# Altium schematic sheet 3-core_board.SchDoc
size B
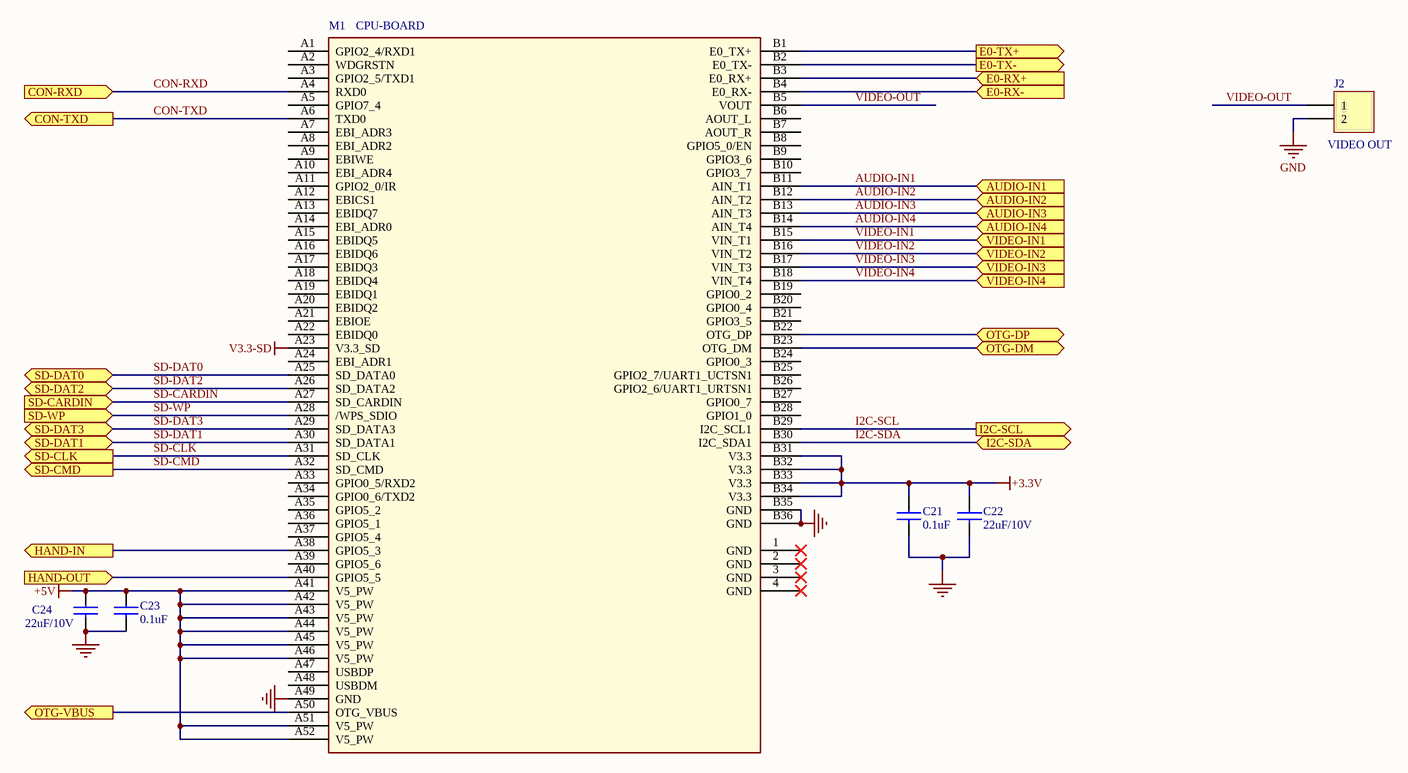
[diagram p0: 3-core_board.SchDoc]

## Parts
C21  0.1uF  [0603]
C22  22uF/10V  [1210]
C23  0.1uF  [0603]
C24  22uF/10V  [1210]
J2  VIDEO OUT  [CON-2PIN]
M1  CPU-BOARD  [cpu-board]

## Ports
AUDIO-IN1 (in), AUDIO-IN2 (in), AUDIO-IN3 (in), AUDIO-IN4 (in), CON-RXD (in), CON-TXD (out), E0-RX+ (in), E0-RX- (in), E0-TX+ (out), E0-TX- (out), HAND-IN (out), HAND-OUT (in), I2C-SCL (out), I2C-SDA (bidir), OTG-DM (bidir), OTG-DP (bidir), OTG-VBUS (out), SD-CARDIN (in), SD-CLK (out), SD-CMD (out), SD-DAT0 (bidir), SD-DAT1 (bidir), SD-DAT2 (bidir), SD-DAT3 (bidir), SD-WP (in), VIDEO-IN1 (in), VIDEO-IN2 (in), VIDEO-IN3 (in), VIDEO-IN4 (in)

## Nets
+3.3V: C21.1 C22.1 M1.B31(V3.3) M1.B32(V3.3) M1.B33(V3.3) M1.B34(V3.3)
+5V: C23.1 C24.1 M1.A41(V5_PW) M1.A42(V5_PW) M1.A43(V5_PW) M1.A44(V5_PW) M1.A45(V5_PW) M1.A46(V5_PW) M1.A51(V5_PW) M1.A52(V5_PW)
GND: C21.2 C22.2 C23.2 C24.2 J2.2 M1.A49(GND) M1.B35(GND) M1.B36(GND)
V3.3-SD: M1.A23(V3.3_SD)
AUDIO-IN1: M1.B11(AIN_T1) ; port AUDIO-IN1
AUDIO-IN2: M1.B12(AIN_T2) ; port AUDIO-IN2
AUDIO-IN3: M1.B13(AIN_T3) ; port AUDIO-IN3
AUDIO-IN4: M1.B14(AIN_T4) ; port AUDIO-IN4
CON-RXD: M1.A4(RXD0) ; port CON-RXD
CON-TXD: M1.A6(TXD0) ; port CON-TXD
E0-RX+: M1.B3(E0_RX+) ; port E0-RX+
E0-RX-: M1.B4(E0_RX-) ; port E0-RX-
E0-TX+: M1.B1(E0_TX+) ; port E0-TX+
E0-TX-: M1.B2(E0_TX-) ; port E0-TX-
HAND-IN: M1.A38(GPIO5_3) ; port HAND-IN
HAND-OUT: M1.A40(GPIO5_5) ; port HAND-OUT
I2C-SCL: M1.B29(I2C_SCL1) ; port I2C-SCL
I2C-SDA: M1.B30(I2C_SDA1) ; port I2C-SDA
OTG-DM: M1.B23(OTG_DM) ; port OTG-DM
OTG-DP: M1.B22(OTG_DP) ; port OTG-DP
OTG-VBUS: M1.A50(OTG_VBUS) ; port OTG-VBUS
SD-CARDIN: M1.A27(SD_CARDIN) ; port SD-CARDIN
SD-CLK: M1.A31(SD_CLK) ; port SD-CLK
SD-CMD: M1.A32(SD_CMD) ; port SD-CMD
SD-DAT0: M1.A25(SD_DATA0) ; port SD-DAT0
SD-DAT1: M1.A30(SD_DATA1) ; port SD-DAT1
SD-DAT2: M1.A26(SD_DATA2) ; port SD-DAT2
SD-DAT3: M1.A29(SD_DATA3) ; port SD-DAT3
SD-WP: M1.A28(/WPS_SDIO) ; port SD-WP
VIDEO-IN1: M1.B15(VIN_T1) ; port VIDEO-IN1
VIDEO-IN2: M1.B16(VIN_T2) ; port VIDEO-IN2
VIDEO-IN3: M1.B17(VIN_T3) ; port VIDEO-IN3
VIDEO-IN4: M1.B18(VIN_T4) ; port VIDEO-IN4
VIDEO-OUT: J2.1 M1.B5(VOUT)

Not connected (* = marked no-connect by the designer): M1 1(GND)* 2(GND)* 3(GND)* 4(GND)* A1(GPIO2_4/RXD1) A2(WDGRSTN) A3(GPIO2_5/TXD1) A5(GPIO7_4) A7(EBI_ADR3) A8(EBI_ADR2) A9(EBIWE) A10(EBI_ADR4) A11(GPIO2_0/IR) A12(EBICS1) A13(EBIDQ7) A14(EBI_ADR0) A15(EBIDQ5) A16(EBIDQ6) A17(EBIDQ3) A18(EBIDQ4) A19(EBIDQ1) A20(EBIDQ2) A21(EBIOE) A22(EBIDQ0) A24(EBI_ADR1) A33(GPIO0_5/RXD2) A34(GPIO0_6/TXD2) A35(GPIO5_2) A36(GPIO5_1) A37(GPIO5_4) A39(GPIO5_6) A47(USBDP) A48(USBDM) B6(AOUT_L) B7(AOUT_R) B8(GPIO5_0/EN) B9(GPIO3_6) B10(GPIO3_7) B19(GPIO0_2) B20(GPIO0_4) B21(GPIO3_5) B24(GPIO0_3) B25(GPIO2_7/UART1_UCTSN1) B26(GPIO2_6/UART1_URTSN1) B27(GPIO0_7) B28(GPIO1_0)

## Library data of the parts
C21-C24 = CAP NP_Dup2
J2 = Header 2: Header, 2-Pin; LatestRevisionDate: 17-Jul-2002; LatestRevisionNote: Re-released for DXP Platform.; Publisher: Altium Limited
M1 = CPU-BOARD_4